# Altium schematic sheet CAN.SchDoc
size A4
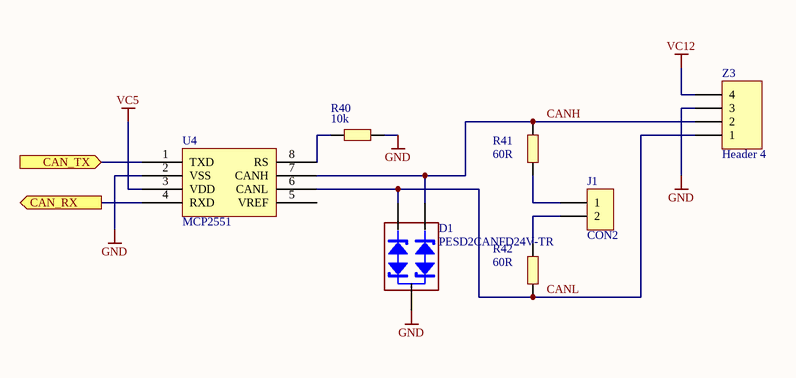
[diagram p0: CAN.SchDoc]

## Parts
D1  PESD2CANFD24V-TR  [SOT23]
J1  CON2  [PIN2]
R40  10k  [0603R]
R41  60R  [1206]
R42  60R  [1206]
U4  MCP2551  [SO8]
Z3  Header 4  [JST-B4B-XH-A]

## Ports
CAN_RX (out), CAN_TX (in)

## Nets
GND: D1.3(CC) R40.2 U4.2(VSS) Z3.3
VC5: U4.3(VDD)
VC12: Z3.4
CAN_RX: U4.4(RXD) ; port CAN_RX
CAN_TX: U4.1(TXD) ; port CAN_TX
CANH: D1.1(K1) R41.2 U4.7(CANH) Z3.2
CANL: D1.2(K2) R42.1 U4.6(CANL) Z3.1
NetJ1_1: J1.1 R41.1
NetJ1_2: J1.2 R42.2
NetR40_1: R40.1 U4.8(RS)

Not connected (* = marked no-connect by the designer): U4 5(VREF)

## Library data of the parts
J1 = CON2: Connector
R40-R42 = RES3
Z3 = Header 4: Header, 4-Pin; LatestRevisionDate: 17-Jul-2002; LatestRevisionNote: Re-released for DXP Platform.; Publisher: Altium Limited